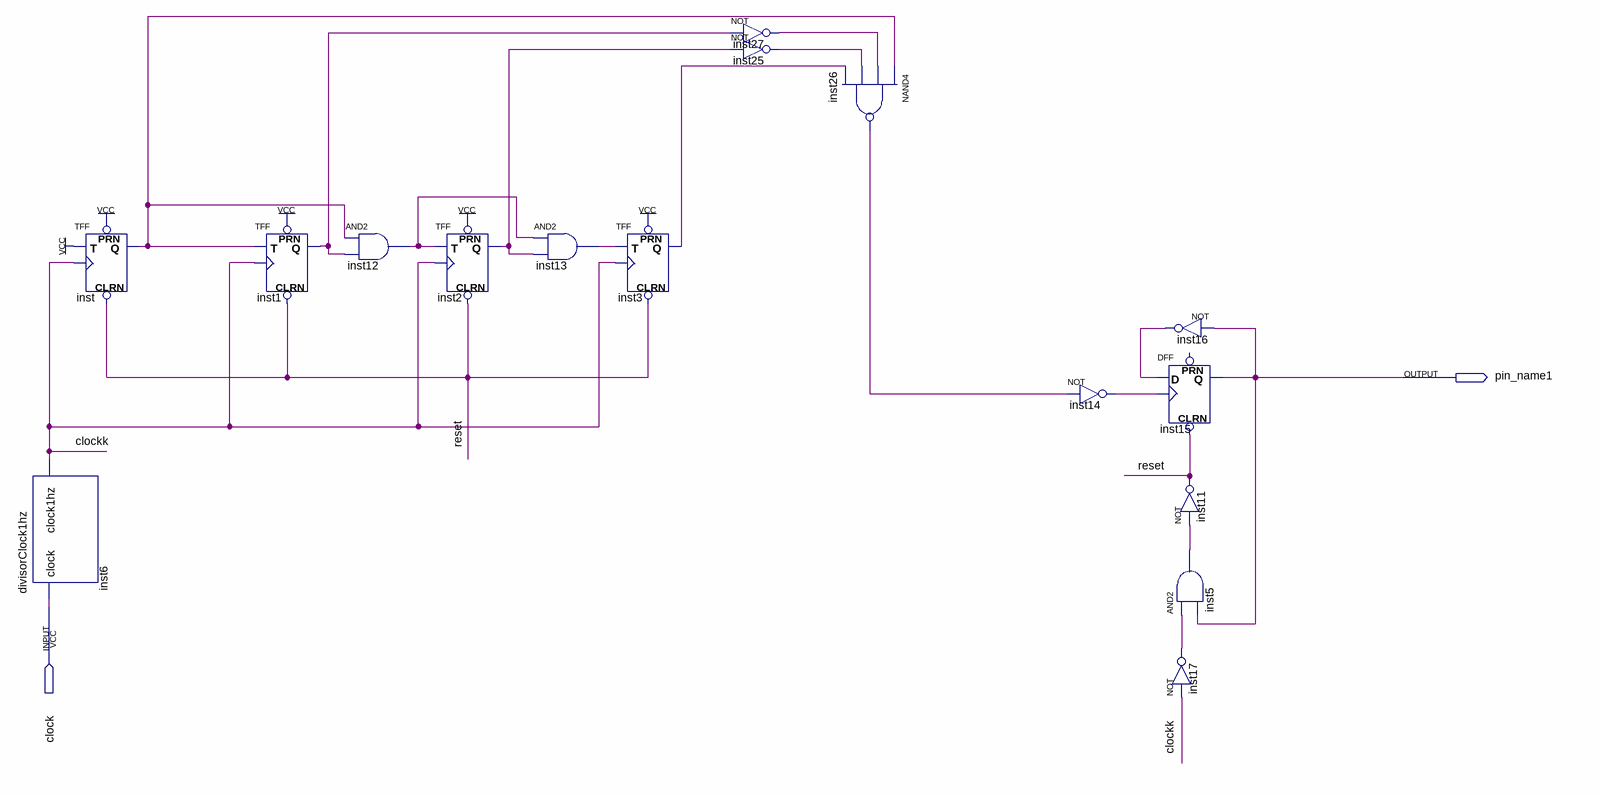
[diagram p0: schematic sheet]
// Quartus schematic ccontadorMod10.bdf as structural Verilog: 16 symbols, 2 pins
module ccontadorMod10 (
  input  clock,
  output pin_name1
);

  wire clockk, inst1_q, inst2_q, inst3_q, inst5_out, inst12_out, inst13_out, inst14_out, inst16_out,
       inst17_out, inst25_out, inst26_out, inst27_out, inst_q, reset;

  TFF inst (.PRN(1'b1), .CLRN(reset), .T(1'b1), .CLK(clockk), .Q(inst_q));
  divisorClock1hz inst6 (.clock(clock), .clock1hz(clockk));
  TFF inst1 (.PRN(1'b1), .CLRN(reset), .T(inst_q), .CLK(clockk), .Q(inst1_q));
  and inst12 (inst12_out, inst_q, inst1_q);
  TFF inst2 (.PRN(1'b1), .CLRN(reset), .T(inst12_out), .CLK(clockk), .Q(inst2_q));
  and inst13 (inst13_out, inst12_out, inst2_q);
  TFF inst3 (.PRN(1'b1), .CLRN(reset), .T(inst13_out), .CLK(clockk), .Q(inst3_q));
  not inst27 (inst27_out, inst1_q);
  not inst25 (inst25_out, inst2_q);
  nand inst26 (inst26_out, inst_q, inst27_out, inst25_out, inst3_q);
  not inst14 (inst14_out, inst26_out);
  not inst16 (inst16_out, pin_name1);
  DFF inst15 (.CLRN(reset), .CLK(inst14_out), .D(inst16_out), .Q(pin_name1));  // open: PRN
  not inst11 (reset, inst5_out);
  and inst5 (inst5_out, inst17_out, pin_name1);
  not inst17 (inst17_out, clockk);
endmodule
